# EasyEDA schematic SCH_ap1-somador-v4_2024-11-25.json
TITLE: Esquema somador de 4 bits com mux e contador de 4 bits; REV: 1.0; Date: 2024-11-25; Sheet: 1/1; Drawn By: mlutegar and andre; Company: André Costa e Michel Lutegar
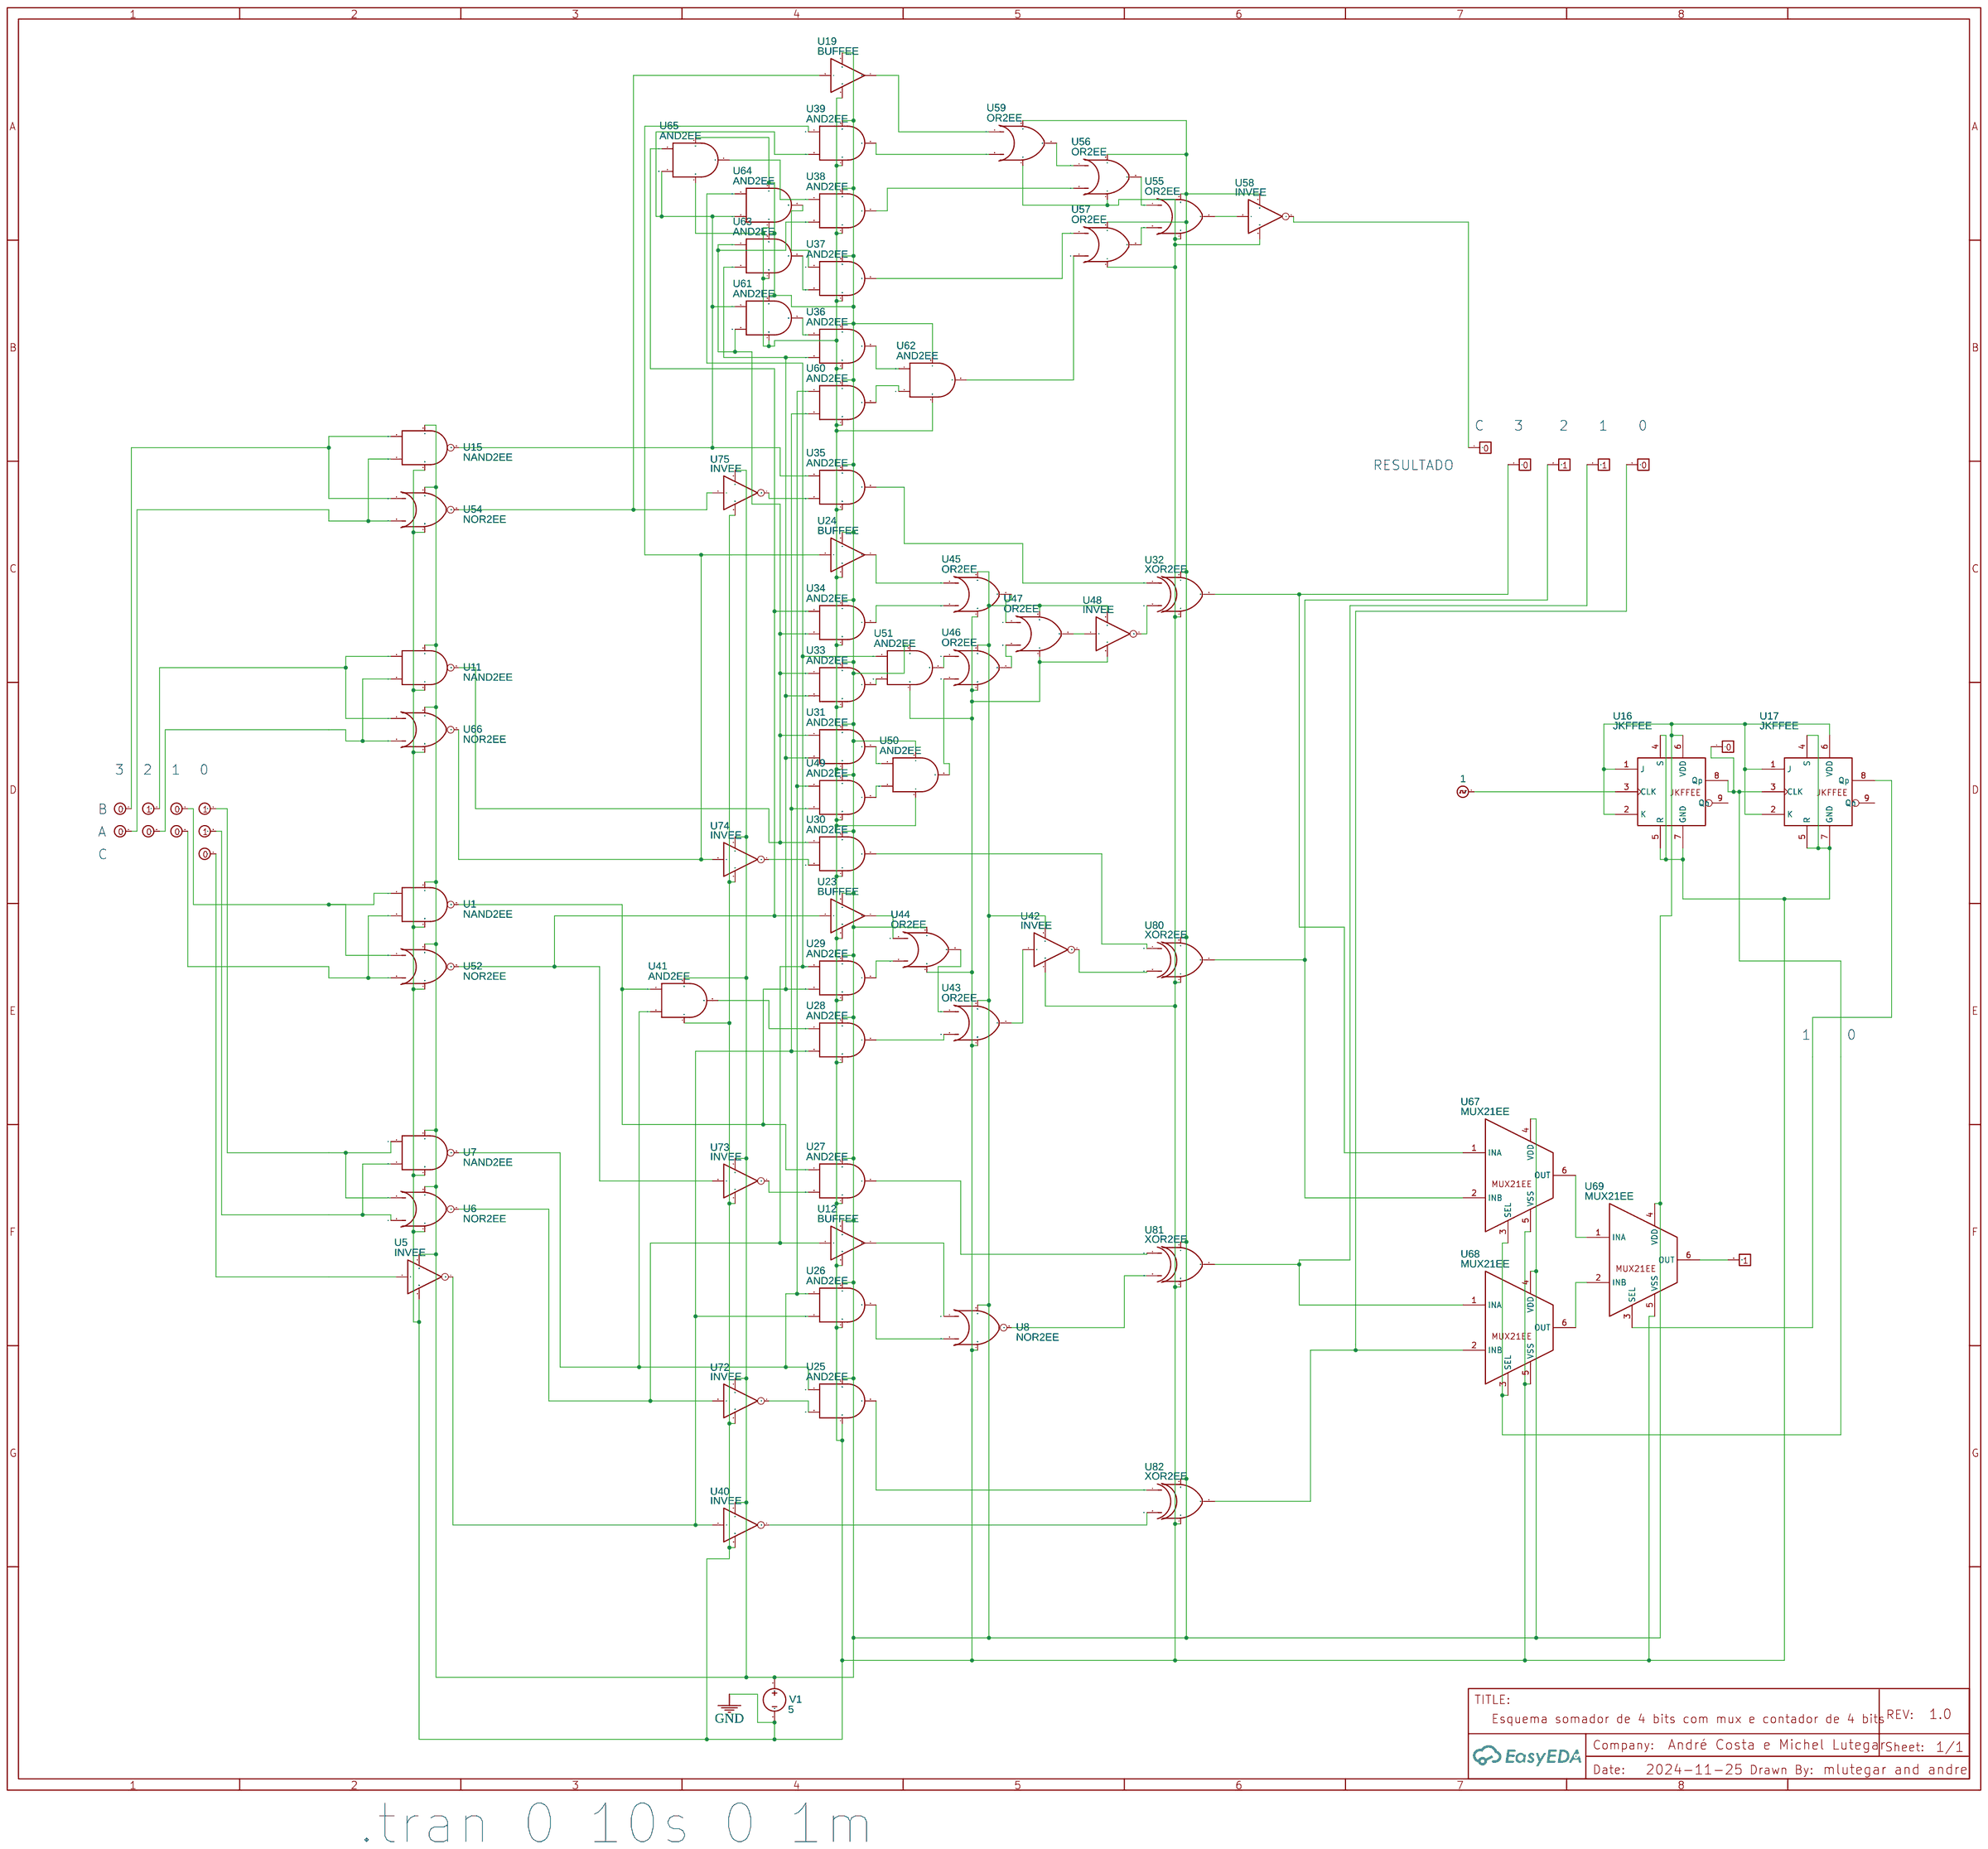
[diagram p0: schematic sheet]

## Parts
U1  NAND2EE
U2  1
U3  Logic_Probe
U4  Logic_Probe
U5  INVEE
U6  NOR2EE
U7  NAND2EE
U8  NOR2EE
U9  Logic_Probe
U10  Logic_Probe
U11  NAND2EE
U12  BUFFEE
U13  Logic_Probe
U14  Logic_Probe
U15  NAND2EE
U16  JKFFEE
U17  JKFFEE
U19  BUFFEE
U23  BUFFEE
U24  BUFFEE
U25  AND2EE
U26  AND2EE
U27  AND2EE
U28  AND2EE
U29  AND2EE
U30  AND2EE
U31  AND2EE
U32  XOR2EE
U33  AND2EE
U34  AND2EE
U35  AND2EE
U36  AND2EE
U37  AND2EE
U38  AND2EE
U39  AND2EE
U40  INVEE
U41  AND2EE
U42  INVEE
U43  OR2EE
U44  OR2EE
U45  OR2EE
U46  OR2EE
U47  OR2EE
U48  INVEE
U49  AND2EE
U50  AND2EE
U51  AND2EE
U52  NOR2EE
U54  NOR2EE
U55  OR2EE
U56  OR2EE
U57  OR2EE
U58  INVEE
U59  OR2EE
U60  AND2EE
U61  AND2EE
U62  AND2EE
U63  AND2EE
U64  AND2EE
U65  AND2EE
U66  NOR2EE
U67  MUX21EE
U68  MUX21EE
U69  MUX21EE
U70  Logic_Probe
U72  INVEE
U73  INVEE
U74  INVEE
U75  INVEE
U77  Logicstate
U78  Logicstate
U79  Logicstate
U80  XOR2EE
U81  XOR2EE
U82  XOR2EE
U83  Logicstate
U84  Logicstate
U85  Logicstate
U86  Logicstate
U87  Logicstate
U88  Logicstate
V1  5  [HDR1X2]

## Library data of the parts
U1 U5-U8 U11 U12 U15 U19 U23-U52 U54-U66 U72-U75 U80-U82 = LOGIC: Contributor: EasyEDA
U2 = DIGITALCLOCK: Contributor: EasyEDA; PreDisplay: 0
U3 U4 U9 U10 U13 U14 U70 = LOGICPROBE: Contributor: EasyEDA; PreDisplay: 0; NameDisplay: 0; Voltage: 0
U16 U17 = LOGIC: Contributor: EasyEDA; sourceId: 8C82kBTN5; Supplier: YUJING
U67-U69 = MUX21EE: Contributor: example; link: https://oshwlab.com/andyfierman/how-to-use-logic-gates-and-devices-in-easyeda-part-1; sim: true
U77-U79 U85 U87 U88 = LOGICSTATE: catid: 20; Contributor: EasyEDA; NameDisplay: 0; 值: 0; PreDisplay: 0; State: low
U83 U84 U86 = LOGICSTATE: catid: 20; Contributor: EasyEDA; NameDisplay: 0; 值: 0; PreDisplay: 0; State: high
V1 = VDC: Contributor: EasyEDA; sim: true

## Nets
GND: U1.4(GND) U5.3(GND) U6.4(GND) U7.4(GND) U8.4(GND) U11.4(GND) U12.3(GND) U15.4(GND) U16.4(S) U16.5(R) U16.7(GND) U17.4(S) U17.5(R) U17.7(GND) U19.3(GND) U23.3(GND) U24.3(GND) U25.4(GND) U26.4(GND) U27.4(GND) U28.4(GND) U29.4(GND) U30.4(GND) U31.4(GND) U32.4(GND) U33.4(GND) U34.4(GND) U35.4(GND) U36.4(GND) U37.4(GND) U38.4(GND) U39.4(GND) U40.3(GND) U41.4(GND) U42.3(GND) U43.4(GND) U44.4(GND) U45.4(GND) U46.4(GND) U47.4(GND) U48.3(GND) U49.4(GND) U50.4(GND) U51.4(GND) U52.4(GND) U54.4(GND) U55.4(GND) U56.4(GND) U57.4(GND) U58.3(GND) U59.4(GND) U60.4(GND) U61.4(GND) U62.4(GND) U63.4(GND) U64.4(GND) U65.4(GND) U66.4(GND) U67.5(VSS) U68.5(VSS) U69.5(VSS) U72.3(GND) U73.3(GND) U74.3(GND) U75.3(GND) U80.4(GND) U81.4(GND) U82.4(GND) V1.2
Net-(U1-1): U1.1(INA) U52.1(INA) U85.1
Net-(U1-2): U1.2(INB) U52.2(INB) U79.1
Net-(U1-3): U1.3(VDD) U5.2(VDD) U6.3(VDD) U7.3(VDD) U8.3(VDD) U11.3(VDD) U12.2(VDD) U15.3(VDD) U16.1(J) U16.2(K) U16.6(VDD) U17.1(J) U17.2(K) U17.6(VDD) U19.2(VDD) U23.2(VDD) U24.2(VDD) U25.3(VDD) U26.3(VDD) U27.3(VDD) U28.3(VDD) U29.3(VDD) U30.3(VDD) U31.3(VDD) U32.3(VDD) U33.3(VDD) U34.3(VDD) U35.3(VDD) U36.3(VDD) U37.3(VDD) U38.3(VDD) U39.3(VDD) U40.2(VDD) U41.3(VDD) U42.2(VDD) U43.3(VDD) U44.3(VDD) U45.3(VDD) U46.3(VDD) U47.3(VDD) U48.2(VDD) U49.3(VDD) U50.3(VDD) U51.3(VDD) U52.3(VDD) U54.3(VDD) U55.3(VDD) U56.3(VDD) U57.3(VDD) U58.2(VDD) U59.3(VDD) U60.3(VDD) U61.3(VDD) U62.3(VDD) U63.3(VDD) U64.3(VDD) U65.3(VDD) U66.3(VDD) U67.4(VDD) U68.4(VDD) U69.4(VDD) U72.2(VDD) U73.2(VDD) U74.2(VDD) U75.2(VDD) U80.3(VDD) U81.3(VDD) U82.3(VDD) V1.1
Net-(U1-5): U1.5(OUT) U27.1(INA) U29.2(INB) U31.2(INB) U33.2(INB) U36.2(INB) U41.1(INA) U63.2(INB)
Net-(U2-1): U2.1 U16.3(CLK)
Net-(U3-1): U3.1 U16.8(Qp) U17.3(CLK) U67.3(SEL) U68.3(SEL)
Net-(U4-1): U4.1 U32.5(OUT) U67.1(INA)
Net-(U5-1): U5.1(IN) U88.1
Net-(U5-4): U5.4(OUT) U26.2(INB) U28.2(INB) U40.1(IN) U49.2(INB) U60.2(INB)
Net-(U6-1): U6.1(INA) U7.1(INA) U84.1
Net-(U6-2): U6.2(INB) U7.2(INB) U83.1
Net-(U6-5): U6.5(OUT) U12.1(IN) U29.1(INA) U51.1(INA) U64.1(INA) U72.1(IN)
Net-(U7-5): U7.5(OUT) U25.1(INA) U26.1(INA) U41.2(INB) U49.1(INA) U60.1(INA)
Net-(U8-1): U8.1(INA) U12.4(OUT)
Net-(U8-2): U8.2(INB) U26.5(OUT)
Net-(U8-5): U8.5(OUT) U81.2(INB)
Net-(U9-1): U9.1 U67.2(INB) U80.5(OUT)
Net-(U10-1): U10.1 U68.1(INA) U81.5(OUT)
Net-(U11-1): U11.1(INA) U66.1(INA) U86.1
Net-(U11-2): U11.2(INB) U66.2(INB) U78.1
Net-(U11-5): U11.5(OUT) U30.1(INA) U31.1(INA) U33.1(INA) U34.2(INB) U38.2(INB) U61.2(INB) U63.1(INA)
Net-(U13-1): U13.1 U68.2(INB) U82.5(OUT)
Net-(U14-1): U14.1 U58.4(OUT)
Net-(U15-1): U15.1(INA) U54.1(INA) U87.1
Net-(U15-2): U15.2(INB) U54.2(INB) U77.1
Net-(U15-5): U15.5(OUT) U35.1(INA) U39.2(INB) U61.1(INA) U64.2(INB) U65.2(INB)
Net-(U17-8): U17.8(Qp) U69.3(SEL)
Net-(U19-1): U19.1(IN) U54.5(OUT) U75.1(IN)
Net-(U19-4): U19.4(OUT) U59.1(INA)
Net-(U23-1): U23.1(IN) U34.1(INA) U52.5(OUT) U65.1(INA) U73.1(IN)
Net-(U23-4): U23.4(OUT) U44.1(INA)
Net-(U24-1): U24.1(IN) U39.1(INA) U66.5(OUT) U74.1(IN)
Net-(U24-4): U24.4(OUT) U45.1(INA)
Net-(U25-2): U25.2(INB) U72.4(OUT)
Net-(U25-5): U25.5(OUT) U82.1(INA)
Net-(U27-2): U27.2(INB) U73.4(OUT)
Net-(U27-5): U27.5(OUT) U81.1(INA)
Net-(U28-1): U28.1(INA) U41.5(OUT)
Net-(U28-5): U28.5(OUT) U43.2(INB)
Net-(U29-5): U29.5(OUT) U44.2(INB)
Net-(U30-2): U30.2(INB) U74.4(OUT)
Net-(U30-5): U30.5(OUT) U80.1(INA)
Net-(U31-5): U31.5(OUT) U50.1(INA)
Net-(U32-1): U32.1(INA) U35.5(OUT)
Net-(U32-2): U32.2(INB) U48.4(OUT)
Net-(U33-5): U33.5(OUT) U51.2(INB)
Net-(U34-5): U34.5(OUT) U45.2(INB)
Net-(U35-2): U35.2(INB) U75.4(OUT)
Net-(U36-1): U36.1(INA) U61.5(OUT)
Net-(U36-5): U36.5(OUT) U62.1(INA)
Net-(U37-1): U37.1(INA) U64.5(OUT)
Net-(U37-2): U37.2(INB) U63.5(OUT)
Net-(U37-5): U37.5(OUT) U57.1(INA)
Net-(U38-1): U38.1(INA) U65.5(OUT)
Net-(U38-5): U38.5(OUT) U56.2(INB)
Net-(U39-5): U39.5(OUT) U59.2(INB)
Net-(U40-4): U40.4(OUT) U82.2(INB)
Net-(U42-1): U42.1(IN) U43.5(OUT)
Net-(U42-4): U42.4(OUT) U80.2(INB)
Net-(U43-1): U43.1(INA) U44.5(OUT)
Net-(U45-5): U45.5(OUT) U47.1(INA)
Net-(U46-1): U46.1(INA) U51.5(OUT)
Net-(U46-2): U46.2(INB) U50.5(OUT)
Net-(U46-5): U46.5(OUT) U47.2(INB)
Net-(U47-5): U47.5(OUT) U48.1(IN)
Net-(U49-5): U49.5(OUT) U50.2(INB)
Net-(U55-1): U55.1(INA) U56.5(OUT)
Net-(U55-2): U55.2(INB) U57.5(OUT)
Net-(U55-5): U55.5(OUT) U58.1(IN)
Net-(U56-1): U56.1(INA) U59.5(OUT)
Net-(U57-2): U57.2(INB) U62.5(OUT)
Net-(U60-5): U60.5(OUT) U62.2(INB)
Net-(U67-6): U67.6(OUT) U69.1(INA)
Net-(U68-6): U68.6(OUT) U69.2(INB)
Net-(U69-6): U69.6(OUT) U70.1

Not connected (* = marked no-connect by the designer): U16 9(Qn); U17 9(Qn)

## Notes on the sheet
- C
- 3
- 2
- 1
- 0
- RESULTADO
- 3
- 2
- 1
- 0
- B
- A
- C
- 1
- 0
- .tran 0 10s 0 1m
